# EAGLE schematic mini layout_2 (EAGLE 5.11)
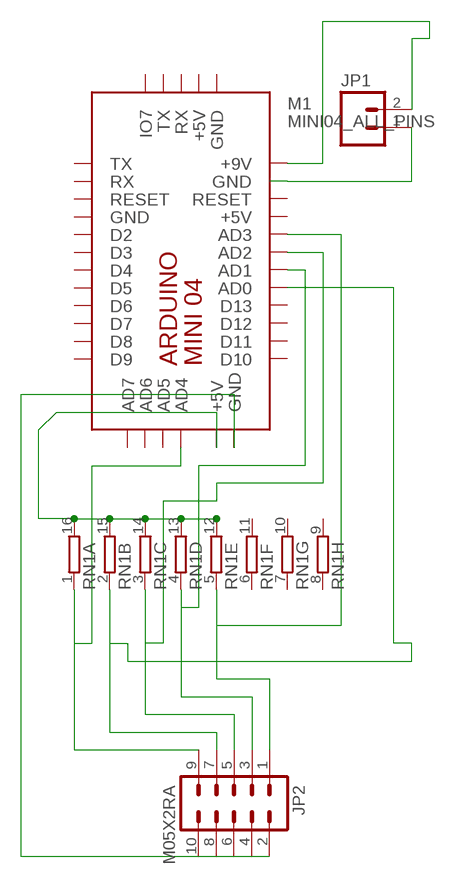
[diagram p0: schematic, sheet 1]

## Parts
JP1  M02LOCK  [1X02_LOCK]
JP2  M05X2RA  [2X5-RA]
M1  MINI04_ALL_PINS  [MINI04_ALL_PINS]
RN1  8R-N  [DIL16]

## Nets
N$1: JP1.1 M1.GND@2(GND)
N$2: JP2.2 JP2.10 M1.GND@3(GND)
N$3: JP2.9 M1.AD4 RN1.1
N$4: JP2.7 M1.AD0 RN1.2
N$6: JP2.3 M1.AD2 RN1.4
N$7: JP2.1 M1.AD3 RN1.5
N$8: JP2.5 M1.AD1 RN1.3
N$9: JP1.2 M1.+9V
N$10: M1.+5V@2(+5V) RN1.12 RN1.13 RN1.14 RN1.15 RN1.16
Unconnected: JP2.4 JP2.6 JP2.8 M1.AD5 M1.AD6 M1.AD7 M1.D2 M1.D3 M1.D4 M1.D5 M1.D6 M1.D7 M1.D8 M1.D9 M1.D10 M1.D11 M1.D12 M1.D13 M1.IO7 M1.RESET@1(RESET) M1.RESET@2(RESET) M1.RX@1(RX) M1.RX@2(RX) M1.TX@1(TX) M1.TX@2(TX) RN1.6 RN1.7 RN1.8 RN1.9 RN1.10 RN1.11

## Power pins joined to a net without a drawn wire
+5V: M1.+5V@1(+5V) M1.+5V@3(+5V)
GND: M1.GND@1(GND) M1.GND@4(GND)

## Library data of the parts
JP1 = SparkFun:M02: Header 2 Standard 2-pin 0.1" header. Use with straight break away headers (SKU : PRT-00116), right angle break away headers (PRT-00553), swiss pins (PRT-00743), machine pins (PRT-00117), and female headers (PRT-00115). Molex polarized connector foot print use with SKU : PRT-08233 with associated crimp pins and housings.
JP2 = SparkFun:M05X2: Header 5x2 Standard 10-pin dual row 0.1" header. Commonly used with AVR-ISP. Use with Spark Fun Electronics SKU: PRT-00778
M1 = arduino:MINI04_ALL_PINS
RN1 = resistor-dil:8R-N: DIL RESISTOR; OC_FARNELL: unknown; OC_NEWARK: unknown